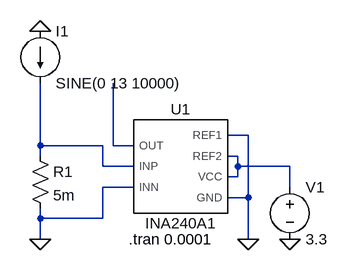
[diagram p0: schematic INA240_test_sine.asc]
INA240_test_sine.asc, the LTspice schematic file:
Version 4.1
SHEET 1 880 680
WIRE 368 128 336 128
WIRE 48 144 48 48
WIRE 144 144 48 144
WIRE 160 144 160 48
WIRE 192 144 160 144
WIRE 48 160 48 144
WIRE 352 160 336 160
WIRE 144 176 144 144
WIRE 192 176 144 176
WIRE 352 176 352 160
WIRE 432 176 352 176
WIRE 352 192 352 176
WIRE 352 192 336 192
WIRE 192 208 144 208
WIRE 432 208 432 176
WIRE 368 224 368 128
WIRE 368 224 336 224
WIRE 48 256 48 240
WIRE 144 256 144 208
WIRE 144 256 48 256
WIRE 48 288 48 256
WIRE 368 288 368 224
FLAG 48 288 0
FLAG 368 288 0
FLAG 432 288 0
FLAG 48 -32 0
SYMBOL INA240A1 256 176 R0
SYMATTR InstName U1
SYMBOL res 32 144 R0
SYMATTR InstName R1
SYMATTR Value 5m
SYMBOL current 48 -32 R0
WINDOW 123 0 0 Left 0
WINDOW 39 0 0 Left 0
SYMATTR InstName I1
SYMATTR Value SINE(0 13 10000)
SYMBOL voltage 432 192 R0
WINDOW 123 0 0 Left 0
WINDOW 39 0 0 Left 0
SYMATTR InstName V1
SYMATTR Value 3.3
TEXT 184 288 Left 2 !.tran 0.0001

The netlist it stands for:
* INA240_test_sine.asc
X§U1 N002 N001 0 0 N003 N003 0 INA240A1  ; pins OUT INP INN REF1 REF2 VCC GND
R1 N001 0 5m
I1 0 N001 SINE(0 13 10000)
V1 N003 0 3.3
.tran 0.0001
.lib C:\GitHub\Robotic_Manipulator_HSPS\hardware\simulations\spice_models\amplifier\INA240\ina240a1.lib
.backanno
.end